# Altium project upBusSim.PrjPCB
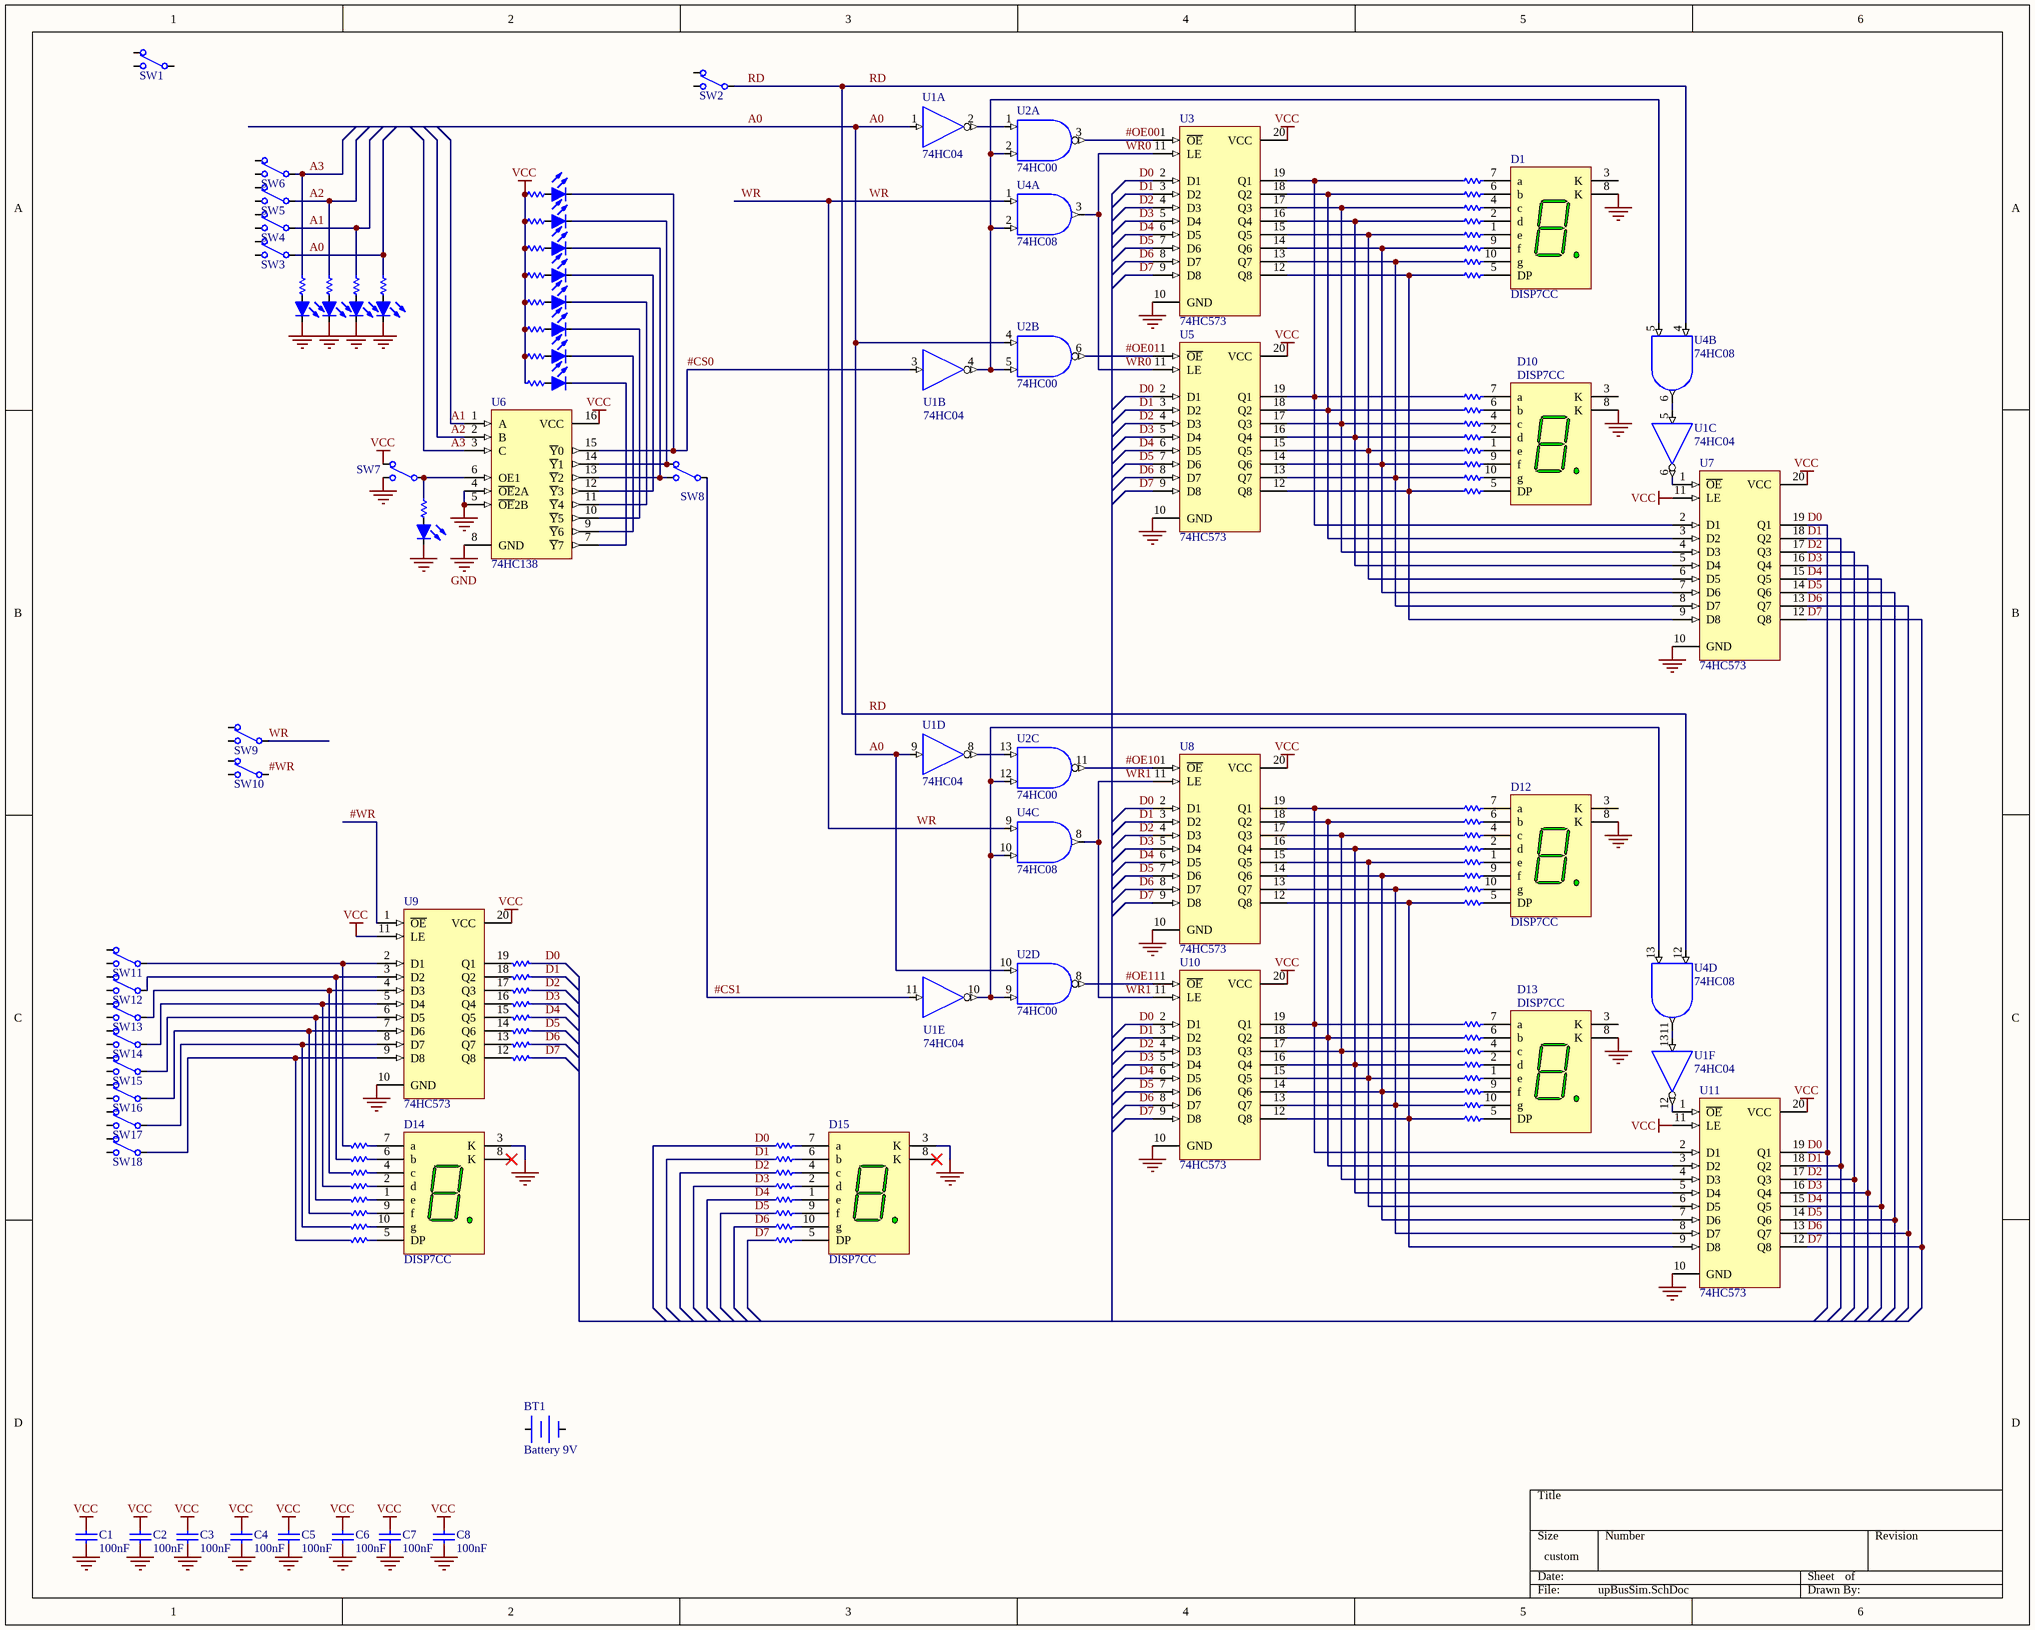
[diagram p0: upBusSim.SchDoc]
1 sheet, 126 parts. Net scope: global (net labels, ports and power ports of the same name join across sheets).
Board file: upBusSim.PcbDoc

## Sheet upBusSim.SchDoc
size 381 x 304 mm

### Parts
BT1  Battery 9V  [BAT_9V]
C1  value 100nF  [c1206]  (hidden comment: Cap)
C2  value 100nF  [c1206]  (hidden comment: Cap)
C3  value 100nF  [c1206]  (hidden comment: Cap)
C4  value 100nF  [c1206]  (hidden comment: Cap)
C5  value 100nF  [c1206]  (hidden comment: Cap)
C6  value 100nF  [c1206]  (hidden comment: Cap)
C7  value 100nF  [c1206]  (hidden comment: Cap)
C8  value 100nF  [c1206]  (hidden comment: Cap)
D1  DISP7CC  [DISP7]
D2  LED  [LED5mm ROJO]  (value not drawn)
D3  LED  [LED5mm ROJO]  (value not drawn)
D4  LED  [LED5mm ROJO]  (value not drawn)
D5  LED  [LED5mm ROJO]  (value not drawn)
D6  LED  [LED5mm ROJO]  (value not drawn)
D7  LED  [LED5mm ROJO]  (value not drawn)
D8  LED  [LED5mm ROJO]  (value not drawn)
D9  LED  [LED5mm ROJO]  (value not drawn)
D10  DISP7CC  [DISP7]
D11  LED  [LED5mm ROJO]  (value not drawn)
D12  DISP7CC  [DISP7]
D13  DISP7CC  [DISP7]
D14  DISP7CC  [DISP7]
D15  DISP7CC  [DISP7]
D16  LED  [LED5mm ROJO]  (value not drawn)
D17  LED  [LED5mm ROJO]  (value not drawn)
D18  LED  [LED5mm ROJO]  (value not drawn)
D19  LED  [LED5mm ROJO]  (value not drawn)
R1  Res  [R1206]  (value not drawn)
R2  Res  [R1206]  (value not drawn)
R3  Res  [R1206]  (value not drawn)
R4  Res  [RES300TH]  (value not drawn)
R5  Res  [R1206]  (value not drawn)
R6  Res  [RES300TH]  (value not drawn)
R7  Res  [RES300TH]  (value not drawn)
R8  Res  [R1206]  (value not drawn)
R9  Res  [R1206]  (value not drawn)
R10  Res  [R1206]  (value not drawn)
R11  Res  [R1206]  (value not drawn)
R12  Res  [R1206]  (value not drawn)
R13  Res  [R1206]  (value not drawn)
R14  Res  [R1206]  (value not drawn)
R15  Res  [R1206]  (value not drawn)
R16  Res  [R1206]  (value not drawn)
R17  Res  [RES300TH]  (value not drawn)
R18  Res  [RES300TH]  (value not drawn)
R19  Res  [RES300TH]  (value not drawn)
R20  Res  [RES300TH]  (value not drawn)
R21  Res  [RES300TH]  (value not drawn)
R22  Res  [RES300TH]  (value not drawn)
R23  Res  [RES300TH]  (value not drawn)
R24  Res  [RES300TH]  (value not drawn)
R25  Res  [R1206]  (value not drawn)
R26  Res  [RES300TH]  (value not drawn)
R27  Res  [RES300TH]  (value not drawn)
R28  Res  [RES300TH]  (value not drawn)
R29  Res  [RES300TH]  (value not drawn)
R30  Res  [RES300TH]  (value not drawn)
R31  Res  [RES300TH]  (value not drawn)
R32  Res  [RES300TH]  (value not drawn)
R33  Res  [RES300TH]  (value not drawn)
R34  Res  [R1206]  (value not drawn)
R35  Res  [R1206]  (value not drawn)
R36  Res  [R1206]  (value not drawn)
R37  Res  [R1206]  (value not drawn)
R38  Res  [R1206]  (value not drawn)
R39  Res  [R1206]  (value not drawn)
R40  Res  [R1206]  (value not drawn)
R41  Res  [R1206]  (value not drawn)
R42  Res  [R1206]  (value not drawn)
R43  Res  [RES300TH]  (value not drawn)
R44  Res  [R1206]  (value not drawn)
R45  Res  [RES300TH]  (value not drawn)
R46  Res  [RES300TH]  (value not drawn)
R47  Res  [R1206]  (value not drawn)
R48  Res  [R1206]  (value not drawn)
R49  Res  [R1206]  (value not drawn)
R50  Res  [RES300TH]  (value not drawn)
R51  Res  [RES300TH]  (value not drawn)
R52  Res  [RES300TH]  (value not drawn)
R53  Res  [RES300TH]  (value not drawn)
R54  Res  [RES300TH]  (value not drawn)
R55  Res  [RES300TH]  (value not drawn)
R56  Res  [RES300TH]  (value not drawn)
R57  Res  [RES300TH]  (value not drawn)
R58  Res  [RES300TH]  (value not drawn)
R59  Res  [RES300TH]  (value not drawn)
R60  Res  [RES300TH]  (value not drawn)
R61  Res  [RES300TH]  (value not drawn)
R62  Res  [RES300TH]  (value not drawn)
R63  Res  [RES300TH]  (value not drawn)
R64  Res  [RES300TH]  (value not drawn)
R65  Res  [RES300TH]  (value not drawn)
R66  Res  [R1206]  (value not drawn)
R67  Res  [R1206]  (value not drawn)
R68  Res  [R1206]  (value not drawn)
R69  Res  [R1206]  (value not drawn)
SW1  SW2C  [SW_PAL_1P2T_PCB]  (value not drawn)
SW2  SW2C  [SW_PAL_1P2T_PCB]  (value not drawn)
SW3  SW2C  [SW_PAL_1P2T_PCB]  (value not drawn)
SW4  SW2C  [SW_PAL_1P2T_PCB]  (value not drawn)
SW5  SW2C  [SW_PAL_1P2T_PCB]  (value not drawn)
SW6  SW2C  [SW_PAL_1P2T_PCB]  (value not drawn)
SW7  SW2C  [SW_PAL_1P2T_PCB]  (value not drawn)
SW8  SW2C  [SW_PAL_1P2T_PCB]  (value not drawn)
SW9  SW2C  [SW_PAL_1P2T_PCB]  (value not drawn)
SW10  SW2C  [SW_PAL_1P2T_PCB]  (value not drawn)
SW11  SW2C  [SW_PAL_1P2T_PCB]  (value not drawn)
SW12  SW2C  [SW_PAL_1P2T_PCB]  (value not drawn)
SW13  SW2C  [SW_PAL_1P2T_PCB]  (value not drawn)
SW14  SW2C  [SW_PAL_1P2T_PCB]  (value not drawn)
SW15  SW2C  [SW_PAL_1P2T_PCB]  (value not drawn)
SW16  SW2C  [SW_PAL_1P2T_PCB]  (value not drawn)
SW17  SW2C  [SW_PAL_1P2T_PCB]  (value not drawn)
SW18  SW2C  [SW_PAL_1P2T_PCB]  (value not drawn)
U1  74HC04  [DIP14Z]  (parts A,B,C,D,E,F of 6)
U2  74HC00  [DIP14Z]  (parts A,B,C,D of 4)
U3  74HC573  [DIP20Z]
U4  74HC08  [DIP14Z]  (parts A,B,C,D of 4)
U5  74HC573  [DIP20Z]
U6  74HC138  [DIP16Z]
U7  74HC573  [DIP20Z]
U8  74HC573  [DIP20Z]
U9  74HC573  [DIP20Z]
U10  74HC573  [DIP20Z]
U11  74HC573  [DIP20Z]

### Nets
GND: C1.1 C2.1 C3.1 C4.1 C5.1 C6.1 C7.1 C8.1 D1.8(K) D10.8(K) D11.2(K) D12.8(K) D13.8(K) D14.3(K) D15.3(K) D16.2(K) D17.2(K) D18.2(K) D19.2(K) SW7.3 U1.7(GND) U2.7(GND) U3.10(GND) U4.7(GND) U5.10(GND) U6.4(~{OE}2A) U6.5(~{OE}2B) U6.8(GND) U7.10(GND) U8.10(GND) U9.10(GND) U10.10(GND) U11.10(GND)
VCC: C1.2 C2.2 C3.2 C4.2 C5.2 C6.2 C7.2 C8.2 R2.2 R5.2 R8.2 R11.2 R13.2 R14.2 R15.2 R16.2 SW7.1 U1.14(VCC) U2.14(VCC) U3.20(VCC) U4.14(VCC) U5.20(VCC) U6.16(VCC) U7.11(LE) U7.20(VCC) U8.20(VCC) U9.11(LE) U9.20(VCC) U10.20(VCC) U11.11(LE) U11.20(VCC)
#CS0: D2.2(K) U1.3(A) U6.15(~{Y}0)
#CS1: SW8.2 U1.11(A)
#OE00: U2.3(~{O}) U3.1(~{OE})
#OE01: U2.6(~{O}) U5.1(~{OE})
#OE10: U2.11(~{O}) U8.1(~{OE})
#OE11: U2.8(~{O}) U10.1(~{OE})
#WR: SW10.2 U9.1(~{OE})
A0: R69.2 SW3.2 U1.1(A) U1.9(A) U2.4(A) U2.10(A)
A1: R68.2 SW4.2 U6.1(A)
A2: R67.2 SW5.2 U6.2(B)
A3: R66.2 SW6.2 U6.3(C)
D0: R34.2 R51.1 U3.2(D1) U5.2(D1) U7.19(Q1) U8.2(D1) U10.2(D1) U11.19(Q1)
D1: R35.2 R53.1 U3.3(D2) U5.3(D2) U7.18(Q2) U8.3(D2) U10.3(D2) U11.18(Q2)
D2: R36.2 R55.1 U3.4(D3) U5.4(D3) U7.17(Q3) U8.4(D3) U10.4(D3) U11.17(Q3)
D3: R37.2 R57.1 U3.5(D4) U5.5(D4) U7.16(Q4) U8.5(D4) U10.5(D4) U11.16(Q4)
D4: R38.2 R59.1 U3.6(D5) U5.6(D5) U7.15(Q5) U8.6(D5) U10.6(D5) U11.15(Q5)
D5: R40.2 R61.1 U3.7(D6) U5.7(D6) U7.14(Q6) U8.7(D6) U10.7(D6) U11.14(Q6)
D6: R42.2 R63.1 U3.8(D7) U5.8(D7) U7.13(Q7) U8.8(D7) U10.8(D7) U11.13(Q7)
D7: R44.2 R65.1 U3.9(D8) U5.9(D8) U7.12(Q8) U8.9(D8) U10.9(D8) U11.12(Q8)
RD: SW2.2 U4.4(A) U4.12(A)
WR: SW9.2 U4.1(A) U4.9(A)
WR0: U3.11(LE) U4.3(Y) U5.11(LE)
WR1: U4.8(Y) U8.11(LE) U10.11(LE)
NetD1_1: D1.1(e) R7.2
NetD1_2: D1.2(d) R6.2
NetD1_4: D1.4(c) R4.2
NetD1_5: D1.5(DP) R12.2
NetD1_6: D1.6(b) R3.2
NetD1_7: D1.7(a) R1.2
NetD1_9: D1.9(f) R9.2
NetD1_10: D1.10(g) R10.2
NetD2_1: D2.1(A) R2.1
NetD3_1: D3.1(A) R5.1
NetD3_2: D3.2(K) SW8.1 U6.14(~{Y}1)
NetD4_1: D4.1(A) R8.1
NetD4_2: D4.2(K) SW8.3 U6.13(~{Y}2)
NetD5_1: D5.1(A) R11.1
NetD5_2: D5.2(K) U6.12(~{Y}3)
NetD6_1: D6.1(A) R13.1
NetD6_2: D6.2(K) U6.11(~{Y}4)
NetD7_1: D7.1(A) R14.1
NetD7_2: D7.2(K) U6.10(~{Y}5)
NetD8_1: D8.1(A) R15.1
NetD8_2: D8.2(K) U6.9(~{Y}6)
NetD9_1: D9.1(A) R16.1
NetD9_2: D9.2(K) U6.7(~{Y}7)
NetD10_1: D10.1(e) R21.2
NetD10_2: D10.2(d) R20.2
NetD10_4: D10.4(c) R19.2
NetD10_5: D10.5(DP) R24.2
NetD10_6: D10.6(b) R18.2
NetD10_7: D10.7(a) R17.2
NetD10_9: D10.9(f) R22.2
NetD10_10: D10.10(g) R23.2
NetD11_1: D11.1(A) R25.1
NetD12_1: D12.1(e) R30.2
NetD12_2: D12.2(d) R29.2
NetD12_4: D12.4(c) R28.2
NetD12_5: D12.5(DP) R33.2
NetD12_6: D12.6(b) R27.2
NetD12_7: D12.7(a) R26.2
NetD12_9: D12.9(f) R31.2
NetD12_10: D12.10(g) R32.2
NetD13_1: D13.1(e) R46.2
NetD13_2: D13.2(d) R45.2
NetD13_4: D13.4(c) R43.2
NetD13_5: D13.5(DP) R49.2
NetD13_6: D13.6(b) R41.2
NetD13_7: D13.7(a) R39.2
NetD13_9: D13.9(f) R47.2
NetD13_10: D13.10(g) R48.2
NetD14_1: D14.1(e) R58.2
NetD14_2: D14.2(d) R56.2
NetD14_4: D14.4(c) R54.2
NetD14_5: D14.5(DP) R64.2
NetD14_6: D14.6(b) R52.2
NetD14_7: D14.7(a) R50.2
NetD14_9: D14.9(f) R60.2
NetD14_10: D14.10(g) R62.2
NetD15_1: D15.1(e) R59.2
NetD15_2: D15.2(d) R57.2
NetD15_4: D15.4(c) R55.2
NetD15_5: D15.5(DP) R65.2
NetD15_6: D15.6(b) R53.2
NetD15_7: D15.7(a) R51.2
NetD15_9: D15.9(f) R61.2
NetD15_10: D15.10(g) R63.2
NetD16_1: D16.1(A) R66.1
NetD17_1: D17.1(A) R67.1
NetD18_1: D18.1(A) R68.1
NetD19_1: D19.1(A) R69.1
NetR1_1: R1.1 R17.1 U3.19(Q1) U5.19(Q1) U7.2(D1)
NetR3_1: R3.1 R18.1 U3.18(Q2) U5.18(Q2) U7.3(D2)
NetR4_1: R4.1 R19.1 U3.17(Q3) U5.17(Q3) U7.4(D3)
NetR6_1: R6.1 R20.1 U3.16(Q4) U5.16(Q4) U7.5(D4)
NetR7_1: R7.1 R21.1 U3.15(Q5) U5.15(Q5) U7.6(D5)
NetR9_1: R9.1 R22.1 U3.14(Q6) U5.14(Q6) U7.7(D6)
NetR10_1: R10.1 R23.1 U3.13(Q7) U5.13(Q7) U7.8(D7)
NetR12_1: R12.1 R24.1 U3.12(Q8) U5.12(Q8) U7.9(D8)
NetR25_2: R25.2 SW7.2 U6.6(OE1)
NetR26_1: R26.1 R39.1 U8.19(Q1) U10.19(Q1) U11.2(D1)
NetR27_1: R27.1 R41.1 U8.18(Q2) U10.18(Q2) U11.3(D2)
NetR28_1: R28.1 R43.1 U8.17(Q3) U10.17(Q3) U11.4(D3)
NetR29_1: R29.1 R45.1 U8.16(Q4) U10.16(Q4) U11.5(D4)
NetR30_1: R30.1 R46.1 U8.15(Q5) U10.15(Q5) U11.6(D5)
NetR31_1: R31.1 R47.1 U8.14(Q6) U10.14(Q6) U11.7(D6)
NetR32_1: R32.1 R48.1 U8.13(Q7) U10.13(Q7) U11.8(D7)
NetR33_1: R33.1 R49.1 U8.12(Q8) U10.12(Q8) U11.9(D8)
NetR34_1: R34.1 U9.19(Q1)
NetR35_1: R35.1 U9.18(Q2)
NetR36_1: R36.1 U9.17(Q3)
NetR37_1: R37.1 U9.16(Q4)
NetR38_1: R38.1 U9.15(Q5)
NetR40_1: R40.1 U9.14(Q6)
NetR42_1: R42.1 U9.13(Q7)
NetR44_1: R44.1 U9.12(Q8)
NetR50_1: R50.1 SW11.2 U9.2(D1)
NetR52_1: R52.1 SW12.2 U9.3(D2)
NetR54_1: R54.1 SW13.2 U9.4(D3)
NetR56_1: R56.1 SW14.2 U9.5(D4)
NetR58_1: R58.1 SW15.2 U9.6(D5)
NetR60_1: R60.1 SW16.2 U9.7(D6)
NetR62_1: R62.1 SW17.2 U9.8(D7)
NetR64_1: R64.1 SW18.2 U9.9(D8)
NetU1_2: U1.2(Y) U2.1(A)
NetU1_4: U1.4(Y) U2.2(B) U2.5(B) U4.2(B) U4.5(B)
NetU1_5: U1.5(A) U4.6(Y)
NetU1_6: U1.6(Y) U7.1(~{OE})
NetU1_8: U1.8(Y) U2.13(A)
NetU1_10: U1.10(Y) U2.9(B) U2.12(B) U4.10(B) U4.13(B)
NetU1_12: U1.12(Y) U11.1(~{OE})
NetU1_13: U1.13(A) U4.11(Y)

Not connected (* = marked no-connect by the designer): D1 3(K); D10 3(K); D12 3(K); D13 3(K); D14 8(K)*; D15 8(K)*; SW1 1 2 3; SW2 1 3; SW3 1 3; SW4 1 3; SW5 1 3; SW6 1 3; SW9 1 3; SW10 1 3; SW11 1 3; SW12 1 3; SW13 1 3; SW14 1 3; SW15 1 3; SW16 1 3; SW17 1 3; SW18 1 3

### Library data of the parts
C1-C8 = Cap: Capacitor; Voltage: 50V; Price: 0.25; Technology: Ceramic
D1 D10 D12-D15 = DISP7CC: CC 7-Segment Display; Price: ?
D2-D9 D11 D16-D19 = LED: Color: Green; Price: ?
R1-R69 = Res: Resistencia; Power: 0.25W; Value: 1K; Price: 0.036
SW1-SW18 = SW2C: Switch de 2 posiciones; Price: ?
U1 = 74HC04: Hex Inverter; Price: ?
U2 = 74HC00: Quad 2-Input NAND Gate; Price: ?
U3 U5 U7-U11 = 74HC573: Octal Transparent D-Type Latches with 3-State Outputs; Revision: 17-Jul-2002: Re-released for DXP Platform.
U4 = 74HC08: Quad 2-Input AND Gate
U6 = 74HC138: 3-Line to 8-Line Decoder / Demultiplexer; Price: ?
BT1 = Battery 9V: Revision: July-2002: Re-released for DXP Platform.